# Altium schematic sheet 充电二板-2.SchDoc
size A4
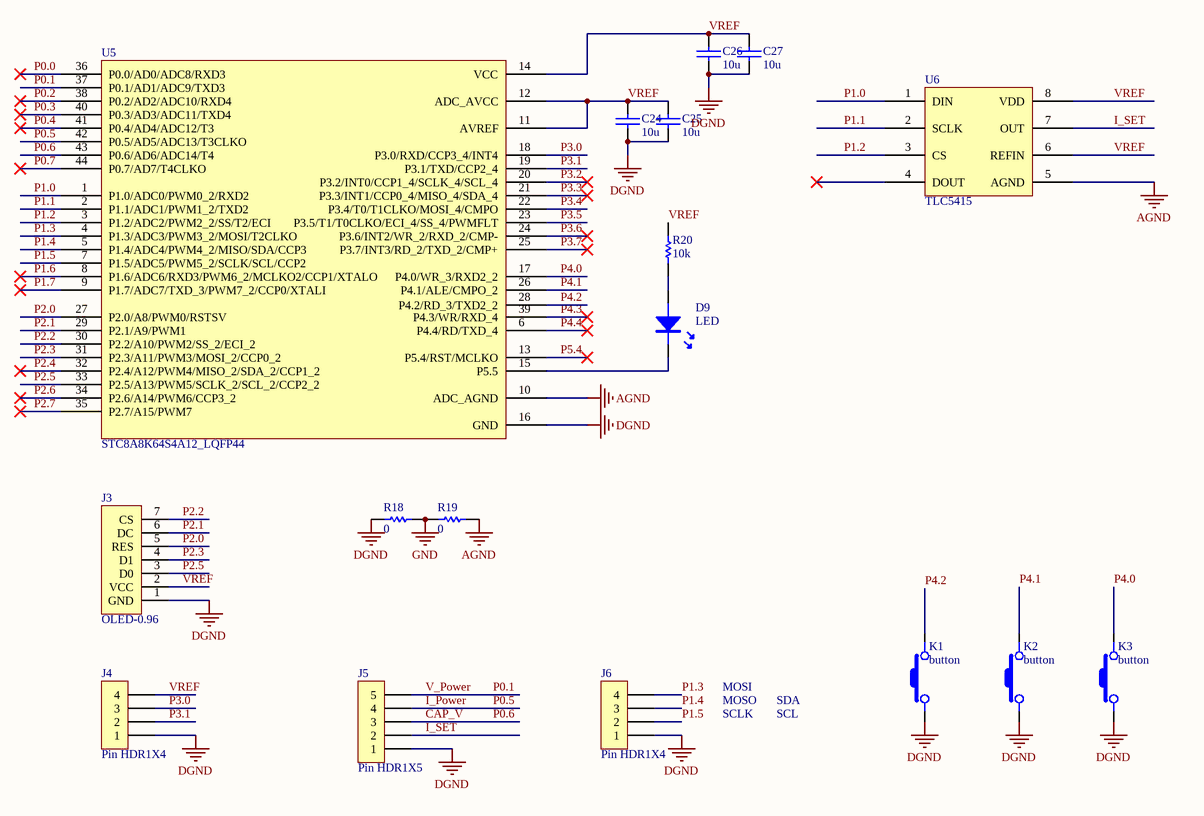
[diagram p0: 充电二板-2.SchDoc]

## Parts
C24  10u  [0603C]
C25  10u  [0603C]
C26  10u  [0603C]
C27  10u  [0603C]
D9  LED  [LED-0603W]
J3  OLED-0.96  [OLED-0.96]
J4  Pin HDR1X4  [Pin HDR1X4/2.54mm-S]
J5  Pin HDR1X5  [Pin HDR1X5/2.54mm-S]
J6  Pin HDR1X4  [Pin HDR1X4/2.54mm-S]
K1  button  [button]
K2  button  [button]
K3  button  [button]
R18  0  [0603R]
R19  0  [0603R]
R20  10k  [0603R]
U5  STC8A8K64S4A12_LQFP44  [LQFP144]
U6  TLC5415  [TLC5415]

## Nets
AGND: R19.2 U5.10(ADC_AGND) U6.5(AGND)
DGND: C24.1 C25.1 C26.1 C27.1 J3.1(GND) J4.1 J5.1 J6.1 K1.1 K2.1 K3.1 R18.1 U5.16(GND)
GND: R18.2 R19.1
CAP_V: J5.3 U5.43(P0.6/AD6/ADC14/T4)  [also labelled P0.6]
I_Power: J5.4 U5.42(P0.5/AD5/ADC13/T3CLKO)  [also labelled P0.5]
I_SET: J5.2 U6.7(OUT)
P0.0: U5.36(P0.0/AD0/ADC8/RXD3)
P0.1: J5.5 U5.37(P0.1/AD1/ADC9/TXD3)  [also labelled V_Power]
P0.2: U5.38(P0.2/AD2/ADC10/RXD4)
P0.3: U5.40(P0.3/AD3/ADC11/TXD4)
P0.4: U5.41(P0.4/AD4/ADC12/T3)
P0.7: U5.44(P0.7/AD7/T4CLKO)
P1.0: U5.1(P1.0/ADC0/PWM0_2/RXD2) U6.1(DIN)
P1.1: U5.2(P1.1/ADC1/PWM1_2/TXD2) U6.2(SCLK)
P1.2: U5.3(P1.2/ADC2/PWM2_2/SS/T2/ECI) U6.3(CS)
P1.3: J6.4 U5.4(P1.3/ADC3/PWM3_2/MOSI/T2CLKO)
P1.4: J6.3 U5.5(P1.4/ADC4/PWM4_2/MISO/SDA/CCP3)
P1.5: J6.2 U5.7(P1.5/ADC5/PWM5_2/SCLK/SCL/CCP2)
P1.6: U5.8(P1.6/ADC6/RXD3/PWM6_2/MCLKO2/CCP1/XTALO)
P1.7: U5.9(P1.7/ADC7/TXD_3/PWM7_2/CCP0/XTALI)
P2.0: J3.5(RES) U5.27(P2.0/A8/PWM0/RSTSV)
P2.1: J3.6(DC) U5.29(P2.1/A9/PWM1)
P2.2: J3.7(CS) U5.30(P2.2/A10/PWM2/SS_2/ECI_2)
P2.3: J3.4(D1) U5.31(P2.3/A11/PWM3/MOSI_2/CCP0_2)
P2.4: U5.32(P2.4/A12/PWM4/MISO_2/SDA_2/CCP1_2)
P2.5: J3.3(D0) U5.33(P2.5/A13/PWM5/SCLK_2/SCL_2/CCP2_2)
P2.6: U5.34(P2.6/A14/PWM6/CCP3_2)
P2.7: U5.35(P2.7/A15/PWM7)
P3.0: J4.3 U5.18(P3.0/RXD/CCP3_4/INT4)
P3.1: J4.2 U5.19(P3.1/TXD/CCP2_4)
P3.2: U5.20(P3.2/INT0/CCP1_4/SCLK_4/SCL_4)
P3.3: U5.21(P3.3/INT1/CCP0_4/MISO_4/SDA_4)
P3.4: U5.22(P3.4/T0/T1CLKO/MOSI_4/CMPO)
P3.5: U5.23(P3.5/T1/T0CLKO/ECI_4/SS_4/PWMFLT)
P3.6: U5.24(P3.6/INT2/WR_2/RXD_2/CMP-)
P3.7: U5.25(P3.7/INT3/RD_2/TXD_2/CMP+)
P4.0: K3.2 U5.17(P4.0/WR_3/RXD2_2)
P4.1: K2.2 U5.26(P4.1/ALE/CMPO_2)
P4.2: K1.2 U5.28(P4.2/RD_3/TXD2_2)
P4.3: U5.39(P4.3/WR/RXD_4)
P4.4: U5.6(P4.4/RD/TXD_4)
P5.4: U5.13(P5.4/RST/MCLKO)
VREF: C24.2 C25.2 C26.2 C27.2 J3.2(VCC) J4.4 R20.1 U5.11(AVREF) U5.12(ADC_AVCC) U5.14(VCC) U6.6(REFIN) U6.8(VDD)
NetD9_A: D9.A R20.2
NetD9_K: D9.K U5.15(P5.5)

Not connected (* = marked no-connect by the designer): U6 4(DOUT)*

## Notes on the sheet
- MOSI
- MOSO
- SCLK
- SDA
- SCL

## Library data of the parts
C24-C27 = CAP: 无极性电容
R18-R20 = RES